# EAGLE design FUSB302-Breakout-ODG (EAGLE 9.6.0)
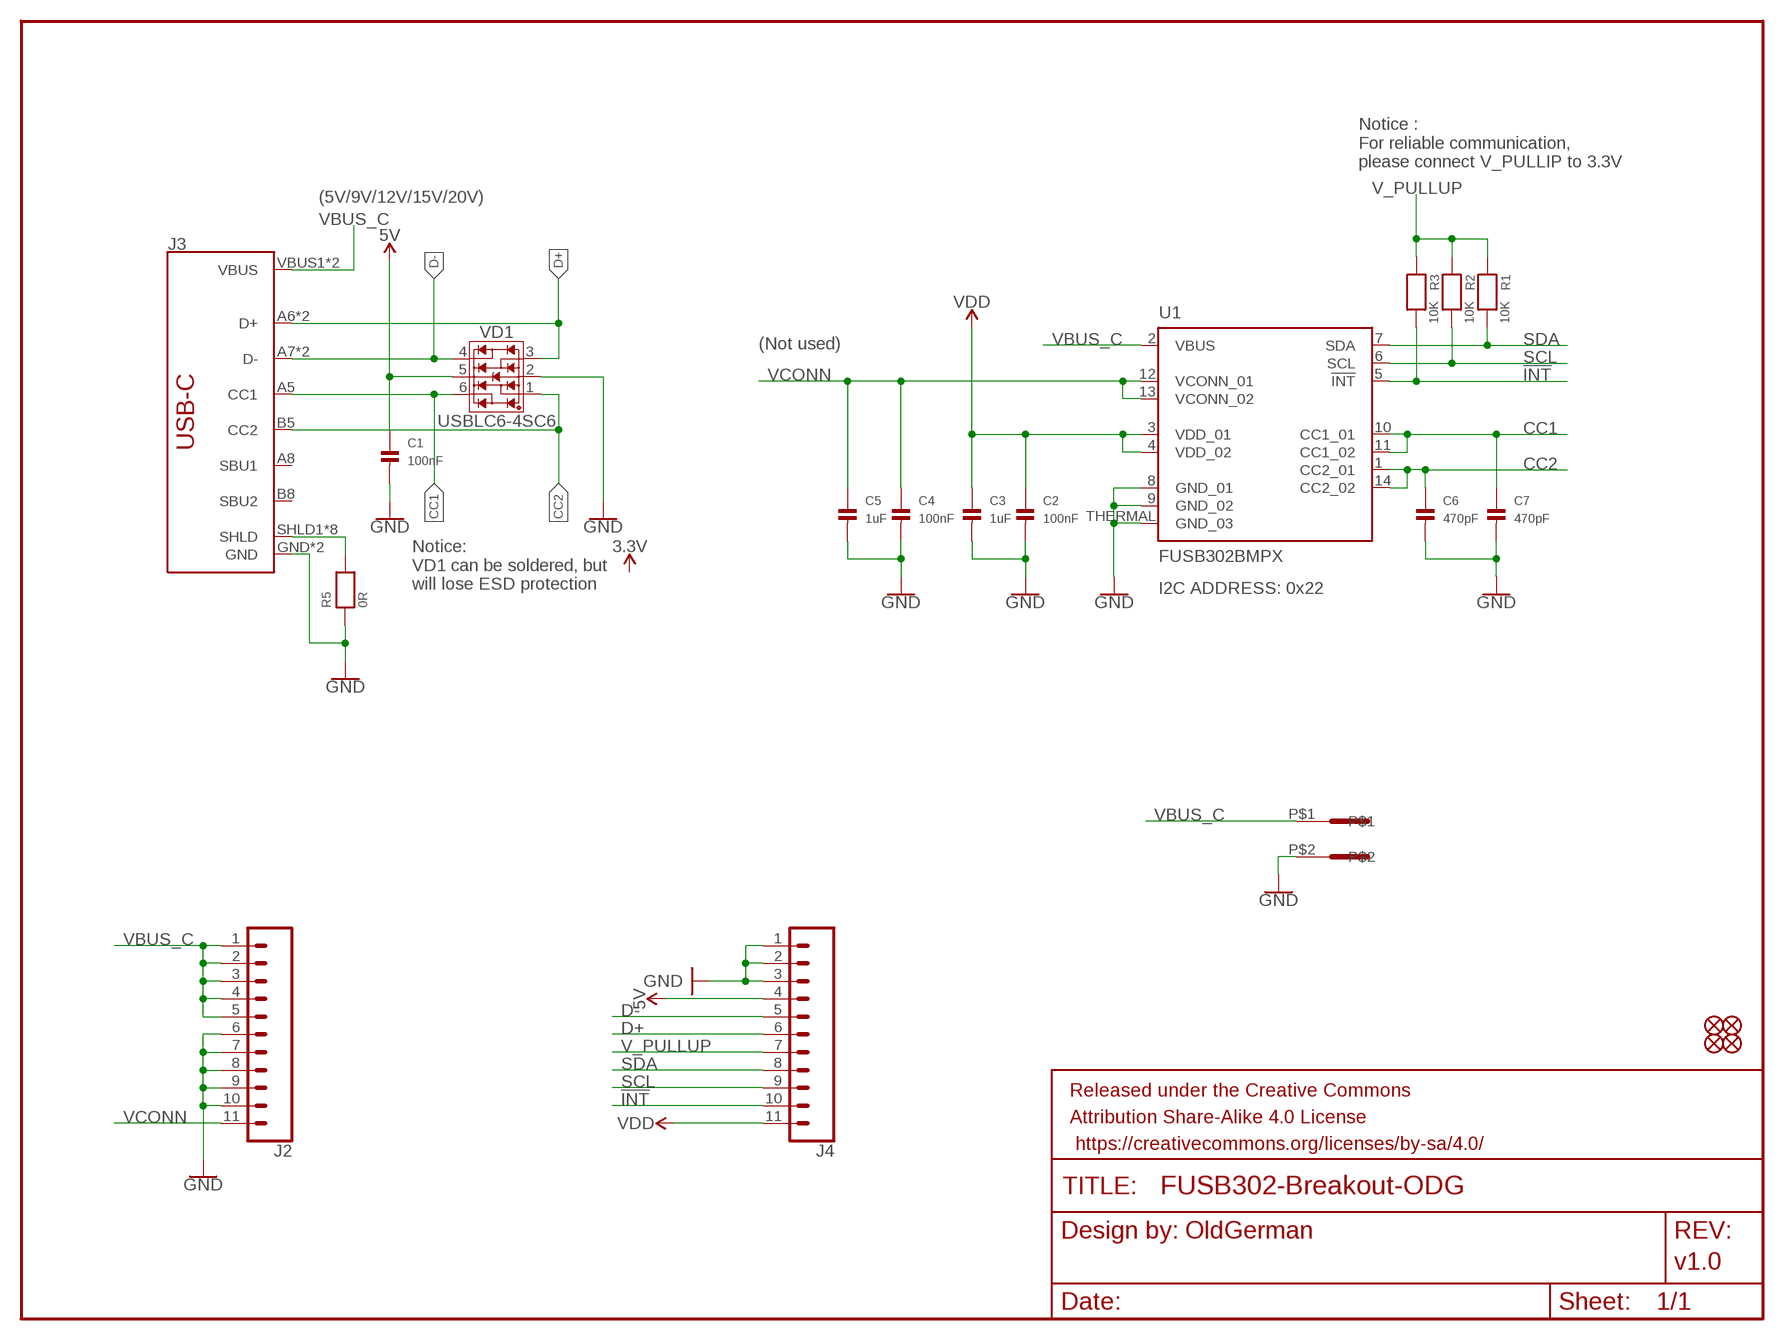
[diagram p0: schematic, sheet 1]

## Parts
C1  100nF  CAP_CERAMIC0603  [0603]
C2  100nF  CAP_CERAMIC0603  [0603]
C3  1uF  CAP_CERAMIC0603  [0603]
C4  100nF  CAP_CERAMIC0603  [0603]
C5  1uF  CAP_CERAMIC0603  [0603]
C6  470pF  CAP_CERAMIC0603  [0603]
C7  470pF  CAP_CERAMIC0603  [0603]
FD5  FIDUCIAL_MINI1X2  [FIDUCIAL-1X2]
FD6  FIDUCIAL_MINI1X2  [FIDUCIAL-1X2]
FD7  FIDUCIAL_MINI1X2  [FIDUCIAL-1X2]
FD8  FIDUCIAL_MINI1X2  [FIDUCIAL-1X2]
FRAME2  FRAME-LETTER  [CREATIVE_COMMONS]
J2  CONN_11  [1X11]
J3  USB_C_LONG-SYMBOL2-LAYER  [USB-C-16P]
J4  CONN_11  [1X11]
R1  10K  RESISTOR0603  [0603]
R2  10K  RESISTOR0603  [0603]
R3  10K  RESISTOR0603  [0603]
R5  0R  RESISTOR0603  [0603]
U1  FUSB302BMPX  FUSB302  [QFN14-2.5X2.5MM]
U$5  5.08MM_CONN  [1715250000]
VD1  USBLC6-4SC6  USBLC6-4SOT23-6  [SOT23-6]

## Nets
5V: C1.1 J4.4 VD1.5
!INT: J4.10 R3.2 U1.5(!INT)
CC1: C7.1 J3.A5(CC1) U1.10(CC1_01) U1.11(CC1_02) VD1.6
CC2: C6.1 J3.B5(CC2) U1.1(CC2_01) U1.14(CC2_02) VD1.1
D+: J3.A6(D+) J3.B6(D+) J4.6 VD1.3
D-: J3.A7(D-) J3.B7(D-) J4.5 VD1.4
GND: C1.2 C2.2 C3.2 C4.2 C5.2 C6.2 C7.2 J2.6 J2.7 J2.8 J2.9 J2.10 J3.GND J3.GND2(GND) J4.1 J4.2 J4.3 R5.1 U1.8(GND_01) U1.9(GND_02) U1.THERMAL(GND_03) U$5.P$2 VD1.2
N$7: J3.SHLD1(SHLD) J3.SHLD2(SHLD) J3.SHLD3(SHLD) J3.SHLD4(SHLD) J3.SHLD5(SHLD) J3.SHLD6(SHLD) J3.SHLD7(SHLD) J3.SHLD8(SHLD) R5.2
SCL: J4.9 R2.2 U1.6(SCL)
SDA: J4.8 R1.2 U1.7(SDA)
V_PULLUP: J4.7 R1.1 R2.1 R3.1
VBUS_C: J2.1 J2.2 J2.3 J2.4 J2.5 J3.VBUS1(VBUS) J3.VBUS2(VBUS) U1.2(VBUS) U$5.P$1
VCONN: C4.1 C5.1 J2.11 U1.12(VCONN_01) U1.13(VCONN_02)
VDD: C2.1 C3.1 J4.11 U1.3(VDD_01) U1.4(VDD_02)
Unconnected: J3.A8(SBU1) J3.B8(SBU2)

## Notes on the sheet
- Notice : 
  For reliable communication, 
  please connect V_PULLIP to 3.3V
- (5V/9V/12V/15V/20V)
- (Not used)
- Notice:
  VD1 can be soldered, but 
  will lose ESD protection
- I2C ADDRESS: 0x22
- OldGerman
- v1.0

## Library data of the parts
C1-C7 = microbuilder:CAP_CERAMIC: Ceramic Capacitors 0402 - 0402 Surface Mount Capacitors 16pF 50V 5% [Digikey: 445-4899-2-ND] 18pF 50V 5% [Digikey: 490-1281-2-ND] 22pF 50V 5% [Digikey: 490-1283-2-ND] 68pF 50V 5% [Digikey: 490-1289-2-ND] 0.1uF 10V 10% [Digikey: 490-1318-2-ND] 1.0uF 6.3V 10% [Digikey: 490-1320-2-ND] 0603 - 0603 Surface Mount Capacitors 16 pF 50V 5% [Digikey: 445-5051-2-ND] 22 pF 50V [Digikey: PCC220ACVTR-ND] 33 pF 50V 5% [Digikey: 490-1415-1-ND] 56pF 50V 5% [Digikey: 490-1421-1-ND] 220pF 50V 5% [Digikey: 445-1285-1-ND] 680 pF 50V 2200 pF 50V 5% C0G [Digikey: 445-1297-1-ND] 5600 pF 100V 5% X7R [Digikey: 478-3711-1-ND] 0.1 µF 25V 10% [Digikey: PCC2277TR-ND] 0.22 µF 16V 10% X7R [Digikey: 445-1318-1-ND] 1.0 µF 25V 10% [Digikey: 445-5146-2-ND] 0603 - RF Specific 3pF 250V +/-0.1pF RF [Digikey: 712-1347-1-ND] 18 pF 250V 5% [Digikey: 478-3505-1-ND or 712-1322-1-ND] 56 pF 250V 5% C0G RF [Digikey: 490-4867-1-ND] 68 pF 250V RF [Digikey: 490-4868-1-ND] 0805 - 0805 Surface Mount Capacitors 220 pF 250V 2% RF Ceramic Capacitor [Digikey: 712-1398-1-ND] 1000 pF 50V 2% NP0 Ceramic Capacitor [Digikey: 478-3760-1-ND] 0.1 µF 25V 10% Ceramic Capacitor [Digikey: PCC1828TR-ND] 1.0 µF 16V 10% Ceramic Capacitor[Digikey: 490-1691-2-ND] 10.0 µF 10V 10% Ceramic Capacitor[Digikey: 709-1228-1-ND] 10.0 uF 16V 10% Ceramic Capacitor [Digikey: 478-5165-2-ND] 47 uF 6.3V 20% Ceramic Capacitor [Digikey: 587-1779-1-ND or 399-5506-1-ND] 1206 - 1206 Surface Mount Capacitors 47uF 10V 20% Ceramic Capacitor [Digikey: 490-5528-1-ND or 399-5508-1-ND or 445-6010-1-ND] 100uF 6.3V -20%, +80% Y5V Ceramic Capacitor (Digikey: 490-4512-1-ND, Mouser: 81-GRM31CF50J107ZE1L)
FD5-FD8 = FUSB302:FIDUCIAL_MINI: Fiducial Alignment Points Point-of-reference for pick-and-place machines and other optical instruments.
FRAME2 = SparkFun-Aesthetics:FRAME-LETTER: Schematic Frame - Letter Standard 8.5x11 US Letter frame
J2 J4 = SparkFun-Connectors:CONN_11: Multi connection point. Often used as Generic Header-pin footprint for 0.1 inch spaced/style header connections On any of the 0.1 inch spaced packages, you can populate with these: Break Away Headers - Straight <https://www.sparkfun.com/products/116> (PRT-00116) Break Away Male Headers - Right Angle <https://www.sparkfun.com/products/553> (PRT-00553) Female Headers <https://www.sparkfun.com/products/115> (PRT-00115) Break Away Headers - Machine Pin <https://www.sparkfun.com/products/117> (PRT-00117) Break Away Female Headers - Swiss Machine Pin <https://www.sparkfun.com/products/743> (PRT-00743) For SCREWTERMINALS and SPRING TERMINALS visit here: Screw Terimnals on SparkFun.com <https://www.sparkfun.com/search/results?term=Screw+Terminals> (5mm/3.5mm/2.54mm spacing) This device is also useful as a general connection point to wire up your design to another part of your project. Our various solder wires solder well into these plated through hole pads. Hook-Up Wire - Assortment (Stranded, 22 AWG) <https://www.sparkfun.com/products/11375> (PRT-11375) Hook-Up Wire - Assortment (Solid Core, 22 AWG) <https://www.sparkfun.com/products/11367> (PRT-11367) View the entire wire category on our website here <https://www.sparkfun.com/categories/141>
J3 = FUSB302:USB_C_LONG-SYMBOL: USB Type C 16Pin Connector Super Speed pins not available on the 16-pin purely SMD connector so this part is best for USB 2.0 implementations. D1 and D2 are tied together enabling D+/- no matter which way the cable is plugged into the connector. The two channel configuration pins (CC1/2) are exposed. These are normally connected to ground via 5.1k resistors but can be reconfigured for high current/high power applications.; PROD_ID: CONN-14122
R1-R3 R5 = microbuilder:RESISTOR: Resistors 0402 - 0402 Surface Mount Package 22 Ohm 1% 1/16W [Digikey: 311-22.0LRTR-ND] 33 Ohm 5% 1/16W 1.0K 5% 1/16W 1.5K 5% 1/16W 2.0K 1% 1/16W 10.0K 1% 1/16W [Digikey: 311-10.0KLRTR-ND] 10.0K 5% 1/16W [Digikey: RMCF0402JT10K0TR-ND] 12.1K 1% 1/16W [Digikey: 311-22.0LRTR-ND] 100.0K 5% 1/16W 0603 - 0603 Surface Mount Package 0 Ohm 1/10 Watt 1% Resistor 15 Ohm 1/10 Watt 1% Resistor 33 Ohm 1/10 Watt 1% Resistor 49.9 Ohm 1/10 Watt 1% Resistor 100 Ohm 1/10 Watt 1% Resistor 150 Ohm 1/10 Watt 1% Resistor 240 Ohm 1/10 Watt 1% Resistor 390 Ohm 1/10 Watt 1% Resistor 560 Ohm 1/10 Watt 1% Resistor 680 Ohm 1/10 Watt 1% Resistor 750 Ohm 1/10 Watt 1% Resistor 1.0K Ohm 1/10 Watt 1% Resistor 1.5K Ohm 1/10 Watt 1% Resistor 2.0K Ohm 1/10 Watt 1% Resistor 2.2K Ohm 1/10 Watt 1% Resistor 3.3K Ohm 1/10 Watt 1% Resistor 4.7K Ohm 1/10 Watt 1% Resistor 10.0K Ohm 1/10 Watt 1% Resistor 12.0K Ohm 1/10 Watt 1% Resistor 12.1K Ohm 1/10 Watt 1% Resistor 20.0K Ohm 1/10 Watt 1% Resistor 33.0K Ohm 1/10 Watt 1% Resistor 100.0K Ohm 1/10 Watt 1% Resistor 0805 - 0805 Surface Mount Package 0 Ohm 1/8 Watt 1% Resistor 33 Ohm 1/8 Watt 1% Resistor 100 Ohm 1/8 Watt 1% Resistor 150 Ohm 1/8 Watt 1% Resistor 200 Ohm 1/8 Watt 1% Resistor 240 Ohm 1/8 Watt 1% Resistor 330 Ohm 1/8 Watt 1% Resistor 390 Ohm 1/8 Watt 1% Resistor 470 Ohm 1/8 Watt 1% Resistor 1.0K Ohm 1/8 Watt 1% Resistor 1.5K Ohm 1/8 Watt 1% Resistor 2.0K Ohm 1/8 Watt 1% Resistor 4.7K Ohm 1/8 Watt 1% Resistor 5.1K Ohm 1/8 Watt 1% Resistor 5.6K Ohm 1/8 Watt 1% Resistor 10.0K Ohm 1/8 Watt 1% Resistor 22.0K Ohm 1/8 Watt 1% Resistor 33.0K Ohm 1/8 Watt 1% Resistor 100K Ohm 1/8 Watt 1% Resistor 1206 - 1206 Surface Mount Package 2012 - 2010 Surface Mount Package 0.11 Ohm 1/2 Watt 1% Resistor - Digikey: RHM.11UCT-ND
U1 = FUSB302:FUSB302: Espressif ESP8266 WiFi/Microcontroller SoC The ESP8266 WiFi Module is a self contained SOC with integrated TCP/IP protocol stack that can give any microcontroller access to your WiFi network. The ESP8266 is capable of either hosting an application or offloading all Wi-Fi networking functions from another application processor. SparkFun Products WiFi Module ESP8266 <https://www.sparkfun.com/products/13678> (WRL-13678) SparkFun ESP8266 Thing <https://www.sparkfun.com/products/13231> (WRL-13231) SparkFun WiFi Shield - ESP8266 <https://www.sparkfun.com/products/13287> (WRL-13287) SparkFun ESP8266 Thing - Dev Board <https://www.sparkfun.com/products/13711> (WRL-13711) SparkFun Blynk Board - ESP8266 <https://www.sparkfun.com/products/13794> (WRL-13794); PROD_ID: IC-12452
U$5 = FUSB302:5.08MM_CONN
VD1 = FUSB302:USBLC6-4

## Board
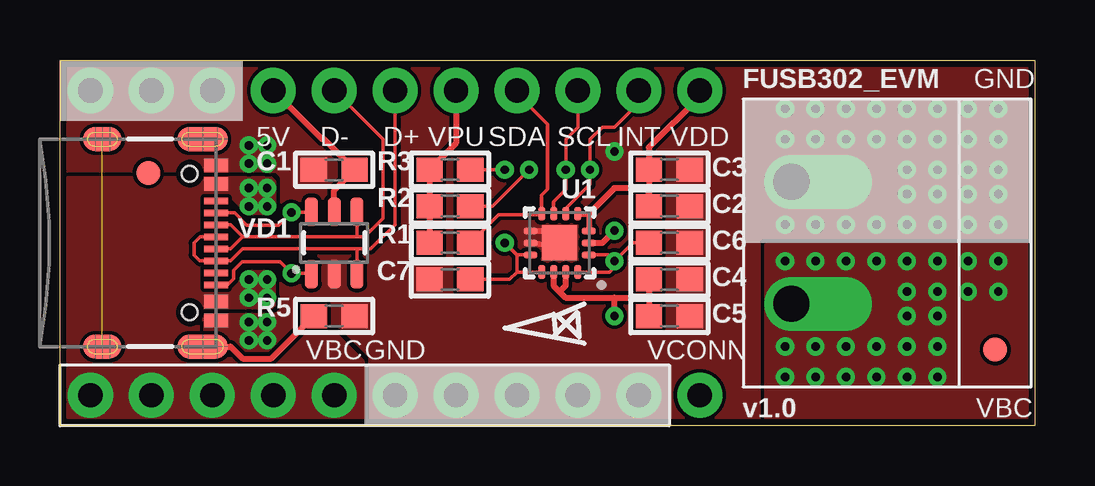
[diagram p1: board, top side]
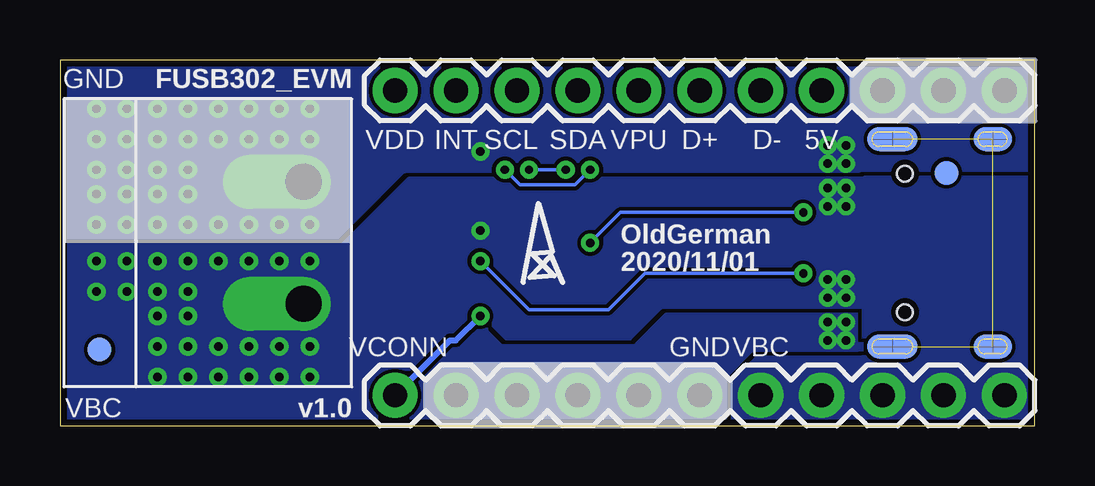
[diagram p2: board, bottom side, seen from below]

Size 40.64 x 15.24 mm. Coordinates in mm from the lower left corner, seen from the top.
Outline: 0,15.24 40.64,15.24 40.64,0 0,0 0,15.24
Copper layers (1*16): Top 0.035mm / dielectric 1.5mm / Bottom 0.035mm
Design rules "default *": minimum track width 6mil, minimum drill 0.35mm, track to track 6mil, track to pad 6mil, pad to pad 6mil, via to via 0mil, smd to smd 6mil, copper to edge 10mil, drill to drill 6mil, minimum pad ring 10mil, minimum via ring 8mil, stop-mask expansion 1mil, vias tented up to drill 25mil, thermal gap 10mil

### Footprints (pad centres in the part's own frame; a part is rotated, then mirrored left to right if it is on the bottom)
0603 = smd 1.1 x 1: 1 -0.85,0; 2 0.85,0
FIDUCIAL-1X2 = smd 1 x 1: 1 0,0
1X11 = drill 1.016 pad 1.88: 1 0,0; 2 2.54,0; 3 5.08,0; 4 7.62,0; 5 10.16,0; 6 12.7,0; 7 15.24,0; 8 17.78,0; 9 20.32,0; 10 22.86,0; 11 25.4,0
USB-C-16P = smd 0.28 x 1: A5 -1.25,-0.34; A6 -0.25,-0.34; A7 0.25,-0.34; A8 1.25,-0.34; B5 1.75,-0.34; B6 0.75,-0.34; B7 -0.75,-0.34; B8 -1.75,-0.34 | smd 0.56 x 1: GND -3.225,-0.34; GND2 3.225,-0.34; VBUS1 -2.45,-0.34; VBUS2 2.45,-0.34 | smd 1 x 2.1: SHLD1 -4.32,-0.915; SHLD2 4.32,-0.915 | smd 1 x 2.1 bottom: SHLD3 -4.32,-0.915; SHLD4 4.32,-0.915 | smd 1 x 1.6: SHLD5 -4.32,-5.095; SHLD8 4.32,-5.095 | smd 1 x 1.6 bottom: SHLD6 -4.32,-5.095; SHLD7 4.32,-5.095 | hole 0.65: -2.89,-1.445; 2.89,-1.445
QFN14-2.5X2.5MM = smd 0.58 x 0.3: 1 -1.215,0.5; 2 -1.215,0; 3 -1.215,-0.5; 8 1.215,-0.5; 9 1.215,0; 10 1.215,0.5 | smd 0.3 x 0.58: 4 -0.75,-1.215; 5 -0.25,-1.215; 6 0.25,-1.215; 7 0.75,-1.215; 11 0.75,1.215; 12 0.25,1.215; 13 -0.25,1.215; 14 -0.75,1.215 | smd 1.45 x 1.45: THERMAL 0,0
1715250000 = drill 1.5 offset: P$1 -2.54,0; P$2 2.54,0
SOT23-6 = smd 0.55 x 1.2: 1 0.95,1.3; 2 0,1.3; 3 -0.95,1.3; 4 -0.95,-1.3; 5 0,-1.3; 6 0.95,-1.3

### Placement (x,y rotation side)
C1  11.43,10.67 180 top
C2  25.4,9.14 0 top
C3  25.4,10.67 0 top
C4  25.4,6.1 0 top
C5  25.4,4.57 0 top
C6  25.4,7.62 0 top
C7  16.26,6.1 180 top
FD5  3.68,10.54 0 top
FD6  38.99,3.17 0 top
FD7  3.68,10.54 0 bottom
FD8  38.99,3.17 0 bottom
FRAME2  -0.76,-11.38 0 top  (outside the outline)
J2  1.27,1.27 180 bottom
J3  6.86,7.62 270 top
J4  1.27,13.97 180 bottom
R1  16.26,7.62 0 top
R2  16.26,9.14 0 top
R3  16.26,10.67 0 top
R5  11.43,4.57 180 top
U1  20.83,7.62 180 top
U$5  30.48,7.62 90 top
VD1  11.43,7.62 180 top

### Tracks (layer width: path | path; a pad name or v marks a point on that pad's centre or on a via)
5V
  Top 0.254: VD1.5 11.43,9.82 C1.1 11.01,11.94 10.92,11.94 J4.4
!INT  (via drill 0.35)
  Top 0.152: J4.10 24.13,13.46 23.11,12.45 22.61,12.45 22.09,11.93 v22.09,10.67 22.09,10.06 21.08,9.04 U1.5 | R3.2 v18.54,10.67
  Bottom 0.152: v22.09,10.67 21.46,10.03 19.18,10.03 v18.54,10.67
CC1  (via drill 0.35)
  Top 0.152: J3.A5 7.28,8.87 7.79,8.36 9.12,8.36 v9.65,8.89 10.45,8.89 VD1.6 | U1.10 19.04,7.12 v18.54,7.62 19.05,7.11 19.05,6.41 | U1.11 19.05,6.41 | 19.05,6.41 18.74,6.1 C7.1
  Bottom 0.152: v18.54,7.62 17.27,8.89 v9.65,8.89
CC2  (via drill 0.35)
  Top 0.152: J3.B5 6.98,5.87 7.25,6.13 7.25,6.49 7.59,6.83 9.17,6.83 v9.65,6.35 10.45,6.35 VD1.1 | U1.1 22.85,7.12 v23.11,6.86 | U1.14 22.91,6.41 23.11,6.6 v23.11,6.86 | C6.1 23.88,7.62 v23.11,6.86
  Bottom 0.152: v23.11,6.86 21.08,4.83 17.78,4.83 16.26,6.35 v9.65,6.35
D+
  Top 0.152: J3.A6 5.84,7.87 5.59,7.62 5.59,7.11 5.83,6.87 J3.B6 7.12,6.87 7.62,7.37 12.45,7.37 | 12.38,6.72 VD1.3 12.38,7.3 12.45,7.37 | J4.6 13.97,8.38 12.95,7.37 12.45,7.37
D-
  Top 0.152: J3.A7 7.12,7.37 7.62,7.87 | J3.B7 7.12,8.37 7.62,7.87 | 12.38,8.52 VD1.4 12.38,7.94 12.45,7.87 | J4.5 13.46,11.94 13.46,8.64 12.7,7.87 12.45,7.87 | 7.62,7.87 12.45,7.87
GND  (via drill 0.35)
  Top 0.254: U1.9 20.83,7.41 20.83,8.13 20.82,8.12 U1.8
  other vias: 7.87,11.68 7.87,10.92 8.64,10.92 8.64,11.68 8.64,3.56 8.64,4.32 7.87,3.56 7.87,4.32 23.11,11.43 32.77,11.94 32.77,8.38 31.5,8.38 30.23,8.38 31.5,11.94 30.23,11.94 34.04,11.94 34.04,8.38 32.77,13.21 31.5,13.21 30.23,13.21 34.04,13.21 37.85,8.38 36.58,8.38 35.31,8.38 39.12,8.38 37.85,10.67 36.58,10.67 35.31,10.67 39.12,10.67 37.85,9.65 36.58,9.65 35.31,9.65 39.12,9.65 37.85,11.94 36.58,11.94 35.31,11.94 39.12,11.94 37.85,13.21 36.58,13.21 35.31,13.21 39.12,13.21
  pour Top (no thermals): 6.1,4.57 6.1,4.06 6.86,4.06 7.62,3.3 8.64,3.3 8.89,3.56 8.89,4.32 8.64,4.57
  pour Bottom (rank 6, no thermals): -1.27,15.24 -1.27,-0.51 40.89,-0.51 40.89,15.75 -1.27,15.75
  pour Top (rank 6, no thermals): -1.27,15.24 -1.27,-0.51 40.89,-0.51 40.89,15.75 -1.27,15.75
  pour Top (no thermals): 6.1,10.67 6.1,11.18 6.86,11.18 7.62,11.94 8.64,11.94 8.89,11.68 8.89,10.92 8.64,10.67
N$7  (7 unrouted)
  Top 0.254: R5.2 8.8,2.79 7.62,2.79 7.11,3.3 J3.SHLD2
SCL  (via drill 0.35)
  Top 0.152: J4.9 21.59,12.45 21.09,11.94 v21.09,10.67 21.09,9.85 20.58,9.34 U1.6 | v19.56,10.67 18.03,9.14 R2.2
  Bottom 0.152: v19.56,10.67 v21.09,10.67
SDA
  Top 0.152: J4.8 19.05,13.84 20.33,12.56 20.33,9.85 20.08,9.6 U1.7 20.04,8.8 18.29,8.8 R1.2
V_PULLUP
  Top 0.254: J4.7 16.51,11.77 R3.1 R2.1 R1.1
VBUS_C  (via drill 0.35)
  Top 0.254: v23.11,8.13 22.61,7.62 U1.2
  other vias: 7.87,9.14 8.64,9.14 7.87,9.91 8.64,9.91 7.87,6.1 7.87,5.33 8.64,5.33 8.64,6.1 32.77,6.86 31.5,6.86 30.23,6.86 34.04,6.86 32.77,3.3 31.5,3.3 30.23,3.3 34.04,3.3 32.77,2.03 31.5,2.03 30.23,2.03 34.04,2.03 37.85,6.86 36.58,6.86 35.31,6.86 39.12,6.86 36.58,3.3 35.31,3.3 36.58,2.03 35.31,2.03 39.12,5.59 37.85,5.59 36.58,5.59 36.58,4.57 35.31,5.59 35.31,4.57
  pour Top (rank 5, no thermals): -1.02,10.29 7.11,10.29 7.11,4.06 8.13,3.05 9.14,3.05 9.91,3.81 11.43,3.81 12.57,2.67 12.57,-0.76 -1.02,-0.76
  pour Top (rank 2, no thermals): 6.1,10.41 8.64,10.41 8.89,10.16 8.89,9.14 8.64,8.89 7.87,8.89 7.11,9.65 6.1,9.65
  pour Top (rank 2, no thermals): 6.1,4.83 8.64,4.83 8.89,5.08 8.89,6.1 8.64,6.35 7.87,6.35 7.11,5.59 6.1,5.59
  pour Bottom (no thermals): 7.11,10.26 7.11,4.95 7.14,4.98 8.08,4.98 15.62,4.95 16.92,3.66 22,3.66 23.01,4.67 24.13,3.56 24.64,3.56 27.18,1.02 27.18,-1.27 41.15,-1.27 41.15,7.49 28.83,7.49 26.06,10.26
  pour Bottom (rank 5, no thermals): -1.02,10.29 7.11,10.29 7.11,2.79 11.56,2.79 12.57,1.78 12.57,-0.76 -1.02,-0.76
  pour Top (rank 2, no thermals): 29.46,7.49 29.46,-2.29 42.42,-2.29 42.42,7.49
VCONN  (via drill 0.35)
  Top 0.254: U1.12 20.58,5.84 20.83,5.59 | 20.83,5.59 21.08,5.84 U1.13 | C4.1 C5.1 24.55,5.33 23.11,5.33 | 20.83,5.59 21.08,5.33 23.11,5.33 | v23.11,4.57 23.11,5.33
  Bottom 0.254: J2.11 24.38,3.56 24.13,3.56 v23.11,4.57
VDD
  Top 0.254: J4.11 26.67,13.72 24.55,11.6 C3.1 C2.1 24.55,9.91 23.11,9.91 22.04,8.84 | U1.4 22.04,8.84 | 22.04,8.84 U1.3

### Text on the board
tPlace: FUSB302_EVM | GND | 5V | D- | D+ | VPU | SDA | SCL | INT | VDD | VBC | GND | VCONN | v1.0 | VBC
bPlace: FUSB302_EVM | GND | 5V | D- | D+ | VPU | SDA | SCL | INT | VDD | OldGerman | 2020/11/01 | VBC | GND | VCONN | v1.0 | VBC
tDocu: OldGerman